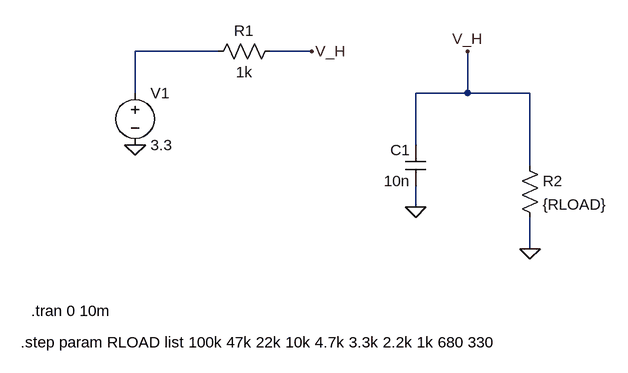
[diagram p0: schematic Stage1_Storage.asc]
Stage1_Storage.asc, the LTspice schematic file:
Version 4.1
SHEET 1 880 680
WIRE 160 80 32 80
WIRE 304 80 240 80
WIRE 32 144 32 80
WIRE 544 144 544 80
WIRE 544 144 464 144
WIRE 640 144 544 144
WIRE 464 224 464 144
WIRE 640 256 640 144
WIRE 464 320 464 288
WIRE 640 384 640 336
FLAG 32 224 0
FLAG 304 80 V_H
FLAG 544 80 V_H
FLAG 640 384 0
FLAG 464 320 0
SYMBOL voltage 32 128 R0
SYMATTR InstName V1
SYMATTR Value 3.3
SYMBOL res 256 64 R90
WINDOW 0 0 56 VBottom 2
WINDOW 3 32 56 VTop 2
SYMATTR InstName R1
SYMATTR Value 1k
SYMBOL res 624 240 R0
SYMATTR InstName R2
SYMATTR Value {RLOAD}
SYMBOL cap 480 288 R180
WINDOW 0 24 56 Left 2
WINDOW 3 24 8 Left 2
SYMATTR InstName C1
SYMATTR Value 10n
TEXT -144 528 Left 2 !.step param RLOAD list 100k 47k 22k 10k 4.7k 3.3k 2.2k 1k 680 330
TEXT -128 480 Left 2 !.tran 0 10m

The netlist it stands for:
* Stage1_Storage.asc
V1 N001 0 3.3
R1 V_H N001 1k
R2 V_H 0 {RLOAD}
C1 0 V_H 10n
.step param RLOAD list 100k 47k 22k 10k 4.7k 3.3k 2.2k 1k 680 330
.tran 0 10m
.backanno
.end